# EasyEDA schematic 1-Schematic_EMWAVER_UNO_V4.json
TITLE: Sheet_1; REV: 1.0; Date: 2022-12-25; Sheet: 1/1; Drawn By: maarnotto; Company: Your Company
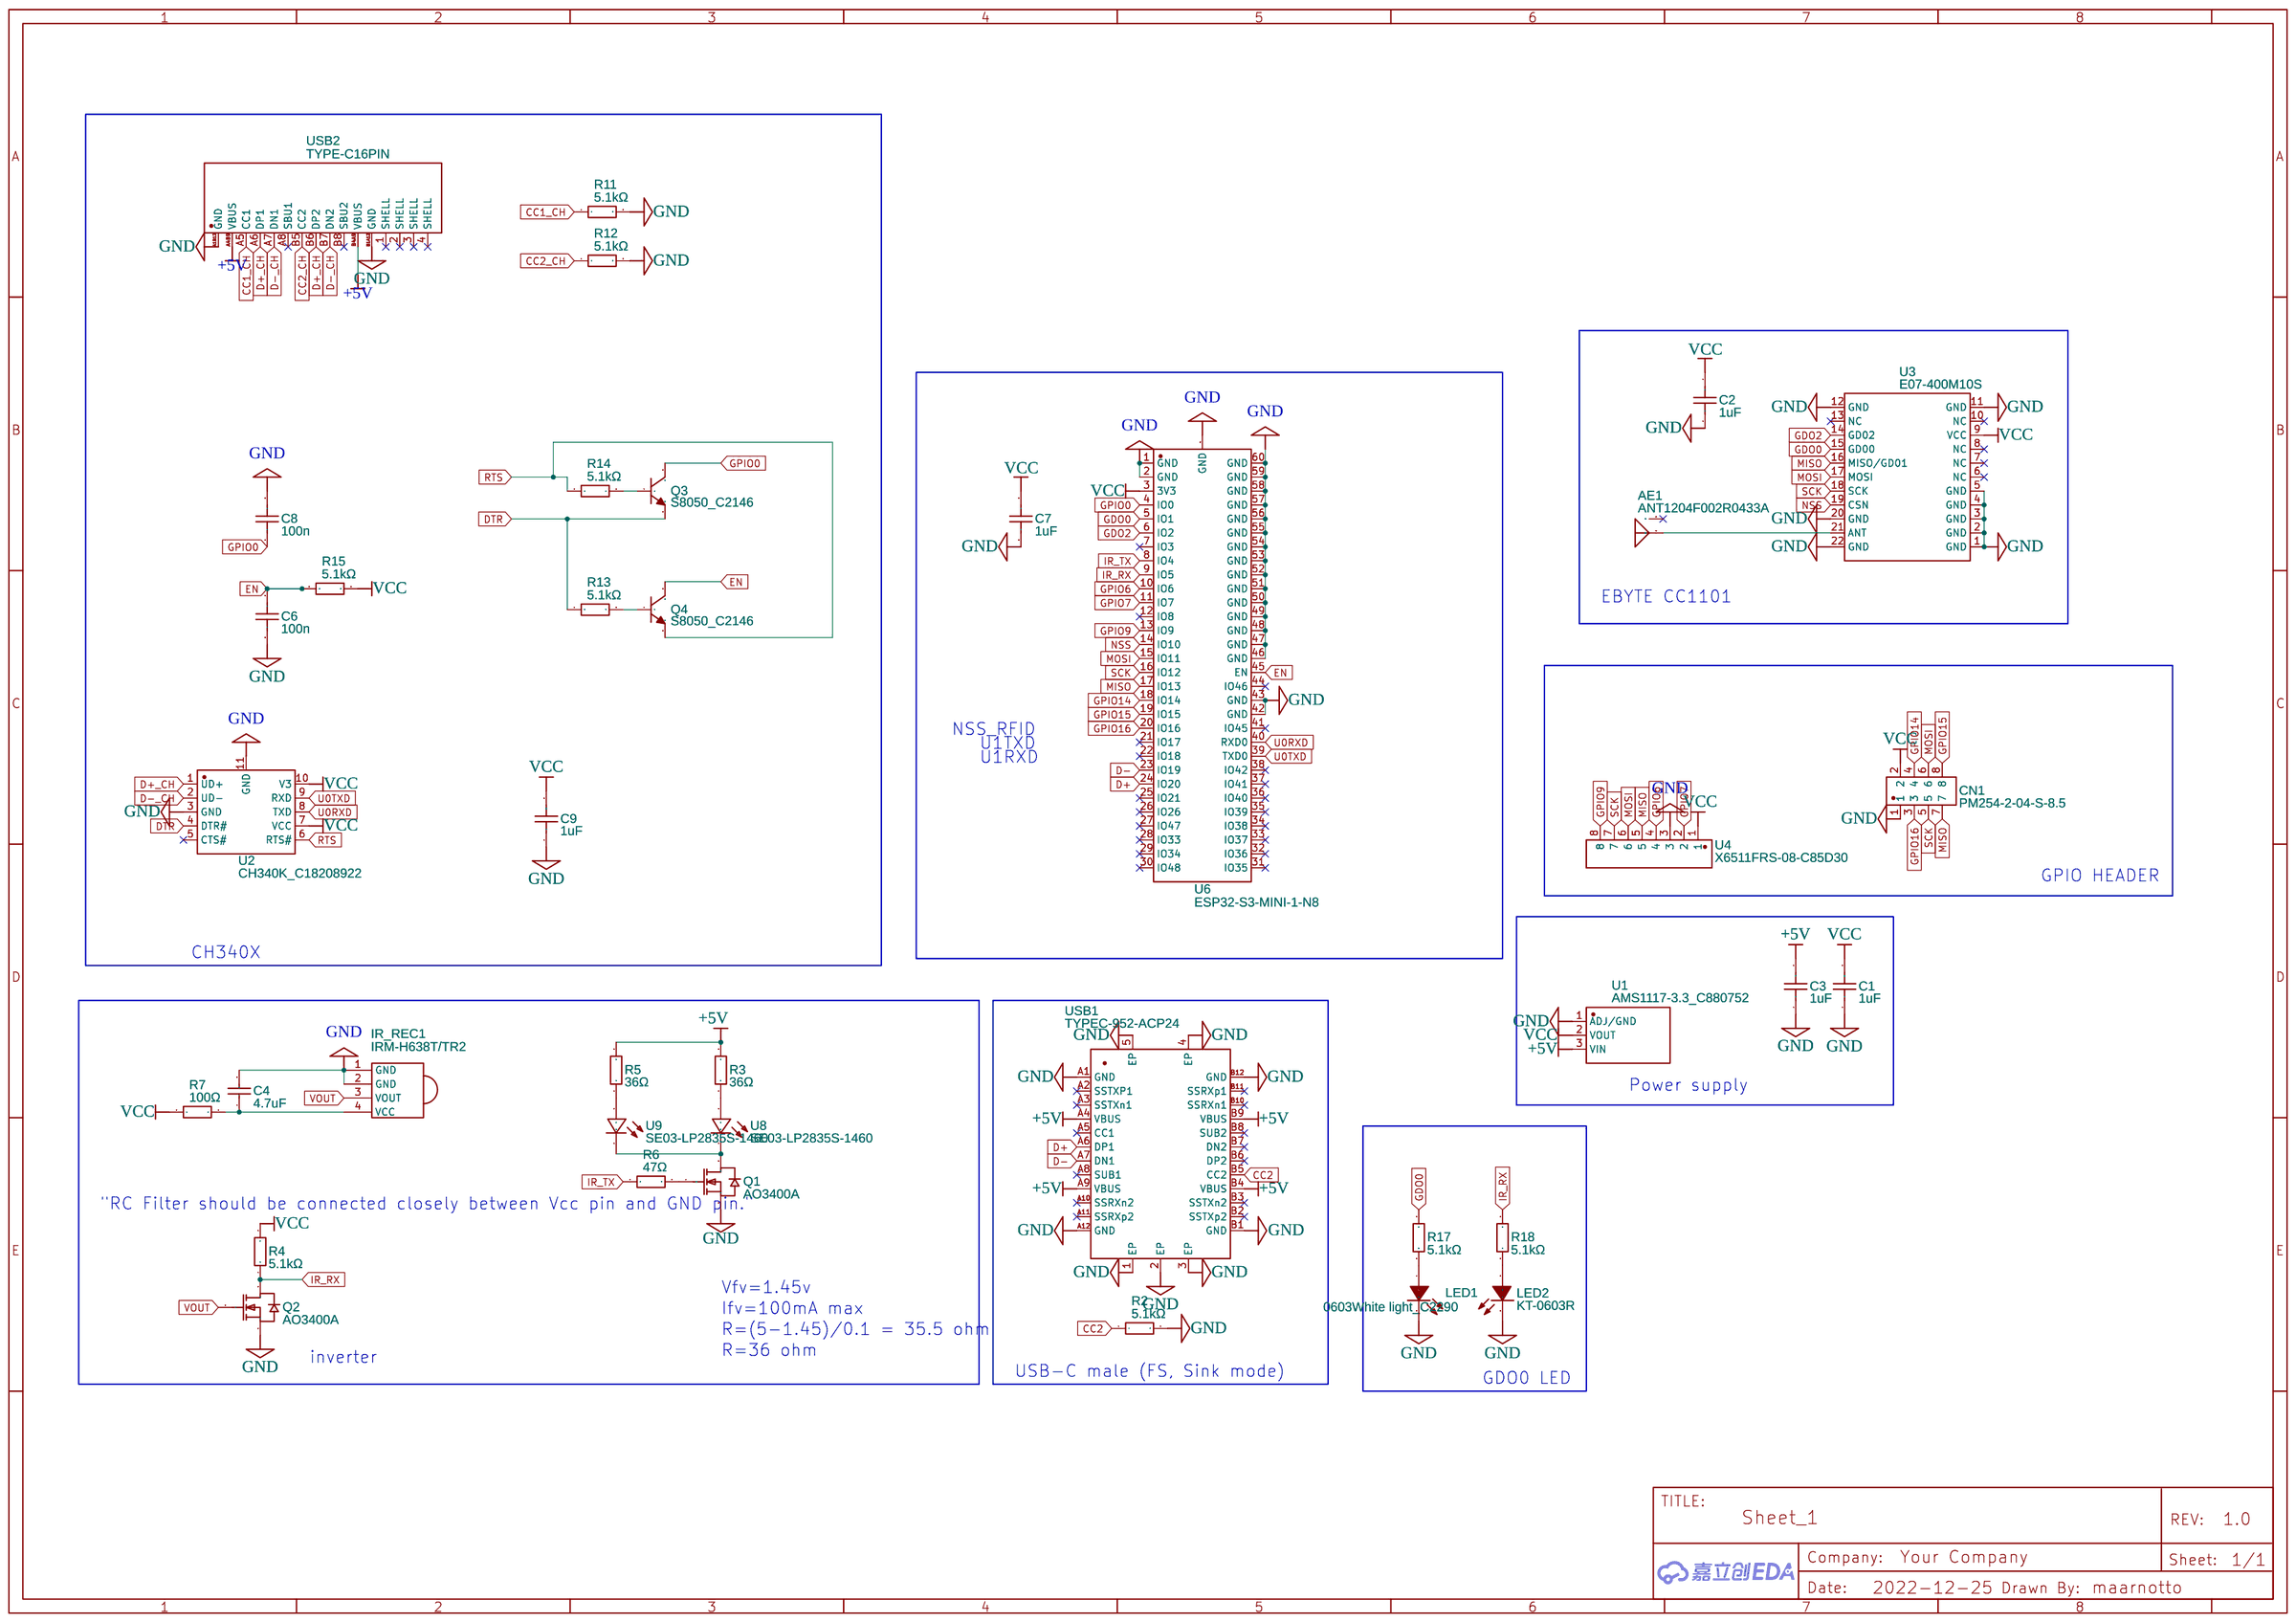
[diagram p0: schematic sheet]

## Parts
AE1  ANT1204F002R0433A  [ANT-SMD_L12.3-W4.0_ANT1204F002R0433A]
C1  1uF  [C0603]
C2  1uF  [C0603]
C3  1uF  [C0603]
C4  4.7uF  [C0603]
C6  100n  [C0402]
C7  1uF  [C0603]
C8  100n  [C0402]
C9  1uF  [C0603]
CN1  PM254-2-04-S-8.5  [HDR-SMD_8P-P2.54-V-F-R2-C4-S7.1]
IR_REC1  IRM-H638T/TR2  [SENSOR-SMD_IRM-H638T-TR2-TL]
LED1  0603White light_C2290  [LED0603-R-RD_WHITE]
LED2  KT-0603R  [LED0603-RD]
Q1  AO3400A  [SOT-23-3_L2.9-W1.6-P1.90-LS2.8-BR]
Q2  AO3400A  [SOT-23-3_L2.9-W1.6-P1.90-LS2.8-BR]
Q3  S8050_C2146  [SOT-23-3_L3.0-W1.7-P0.95-LS2.9-BR]
Q4  S8050_C2146  [SOT-23-3_L3.0-W1.7-P0.95-LS2.9-BR]
R2  5.1kΩ  [R0603]
R3  36Ω  [R1206]
R4  5.1kΩ  [R0603]
R5  36Ω  [R1206]
R6  47Ω  [R0805]
R7  100Ω  [R0805]
R11  5.1kΩ  [R0603]
R12  5.1kΩ  [R0603]
R13  5.1kΩ  [R0603]
R14  5.1kΩ  [R0603]
R15  5.1kΩ  [R0603]
R17  5.1kΩ  [R0603]
R18  5.1kΩ  [R0603]
U1  AMS1117-3.3_C880752  [SOT-89-3_L4.5-W2.5-P1.50-LS4.2-BR]
U2  CH340K_C18208922  [ESOP-10_L4.9-W3.9-P1.00-LS6.0-BL-EP]
U3  E07-400M10S  [COMM-SMD_E07-400M10S]
U4  X6511FRS-08-C85D30  [HDR-SMD_8P-P2.54-H-F-L11.5]
U6  ESP32-S3-MINI-1-N8  [BULETM-SMD_ESP32-S3-MINI-1-N8]
U8  SE03-LP2835S-1460  [SENSOR-SMD_L3.5-W2.8-FD]
U9  SE03-LP2835S-1460  [SENSOR-SMD_L3.5-W2.8-FD]
USB1  TYPEC-952-ACP24  [USB-C-SMD_TYPEC-952-ACP24]
USB2  TYPE-C16PIN  [USB-C-SMD_TYPE-C16PIN]

## Library data of the parts
AE1 = ANT1204F002R0433A: Contributor: LCSC; Supplier: LCSC; Supplier Part: C141525; Manufacturer: YAGEO(国巨); JLCPCB Part Class: Extended Part
C1-C3 C6-C9 = C_0603_US: Contributor: LCEDA_Lib
C4 = CL10A475KO8NNNC: Supplier: LCSC; Manufacturer: SAMSUNG(三星); Supplier Part: C19666; JLCPCB Part Class: Basic Part
CN1 = PM254-2-04-S-8.5: Contributor: lcsc; Supplier: LCSC; Supplier Part: C3975149; Manufacturer: HCTL(华灿天禄); JLCPCB Part Class: Extended Part
IR_REC1 = IRM-H638T/TR2: Supplier: LCSC; Manufacturer: EVERLIGHT(亿光); Supplier Part: C91447; JLCPCB Part Class: Extended Part
LED1 = 0603White light_C2290: Supplier: LCSC; Manufacturer: KENTO; Manufacturer Part: KT-0603W; Supplier Part: C2290; JLCPCB Part Class: Basic Part
LED2 = KT-0603R: Supplier: LCSC; Manufacturer: KENTO; Supplier Part: C2286; JLCPCB Part Class: Basic Part
Q1 Q2 = AO3400A: Supplier: LCSC; Manufacturer: AOS; Supplier Part: C20917; JLCPCB Part Class: Basic Part
Q3 Q4 = S8050_C2146: Supplier: LCSC; Manufacturer: CJ(江苏长电/长晶); Manufacturer Part: S8050 J3Y; Supplier Part: C2146; JLCPCB Part Class: Basic Part
R2 R4 R11-R15 R17 R18 = 0603WAF5101T5E: Supplier: LCSC; Manufacturer: UNI-ROYAL(厚声); Supplier Part: C23186; JLCPCB Part Class: Basic Part
R3 R5 = 1206W4J0360T5E: Supplier: LCSC; Manufacturer: UNI-ROYAL(厚声); Supplier Part: C25377; JLCPCB Part Class: Extended Part
R6 = 0805W8F470JT5E: Supplier: LCSC; Manufacturer: UNI-ROYAL(厚声); Supplier Part: C17714; JLCPCB Part Class: Basic Part
R7 = 0805W8F1000T5E: Supplier: LCSC; Manufacturer: UNI-ROYAL(厚声); Supplier Part: C17408; JLCPCB Part Class: Basic Part
U1 = AMS1117-3.3_C880752: Contributor: LCSC; Supplier: LCSC; Supplier Part: C880752; Manufacturer: Slkor(萨科微); Manufacturer Part: AMS1117-3.3; JLCPCB Part Class: Extended Part
U2 = CH340K_C18208922: Supplier: LCSC; Supplier Part: C18208922; Manufacturer: WCH(南京沁恒); Manufacturer Part: CH340K; Contributor: lcsc; JLCPCB Part Class: Extended Part
U3 = E07-400M10S: Supplier: LCSC; Supplier Part: C2965513; Manufacturer: EBYTE(亿佰特); JLCPCB Part Class: Extended Part; Contributor: lcsc
U4 = X6511FRS-08-C85D30: Contributor: lcsc; Supplier: LCSC; Supplier Part: C5142241; Manufacturer: XKB Connectivity(中国星坤); JLCPCB Part Class: Extended Part
U6 = ESP32-S3-MINI-1-N8: Contributor: lcsc; Supplier: LCSC; Supplier Part: C2913206; Manufacturer: ESPRESSIF(乐鑫); JLCPCB Part Class: Extended Part
U8 U9 = SE03-LP2835S-1460: Contributor: lcsc; Supplier: LCSC; Supplier Part: C5205253; Manufacturer: XSSY(旭晟); JLCPCB Part Class: Extended Part
USB1 = TYPEC-952-ACP24: Contributor: LCSC; Supplier: LCSC; Supplier Part: C2840398; Manufacturer: XUNPU(讯普); JLCPCB Part Class: Extended Part
USB2 = TYPE-C16PIN: Contributor: LCSC; Supplier: LCSC; Supplier Part: C393939; Manufacturer: SHOU HAN(首韩); JLCPCB Part Class: Extended Part

## Nets
+5V: C3.2 R3.2 R5.2 U1.3(VIN) USB1.A4(VBUS) USB1.A9(VBUS) USB1.B4(VBUS) USB1.B9(VBUS) USB2.A4B9(VBUS) USB2.B4A9(VBUS)
GND: C1.1 C2.2 C3.1 C4.2 C6.2 C7.2 C8.2 C9.1 CN1.1 IR_REC1.1(GND) IR_REC1.2(GND) LED1.2(K) LED2.1(K) Q1.2(S) Q2.2(S) R2.2 R11.2 R12.2 U1.1(ADJ/GND) U2.3(GND) U2.11(GND) U3.1(GND) U3.2(GND) U3.3(GND) U3.4(GND) U3.5(GND) U3.11(GND) U3.12(GND) U3.20(GND) U3.22(GND) U4.3 U6.1(GND) U6.2(GND) U6.42(GND) U6.43(GND) U6.46(GND) U6.47(GND) U6.48(GND) U6.49(GND) U6.50(GND) U6.51(GND) U6.52(GND) U6.53(GND) U6.54(GND) U6.55(GND) U6.56(GND) U6.57(GND) U6.58(GND) U6.59(GND) U6.60(GND) U6.GND USB1.1(EP) USB1.2(EP) USB1.3(EP) USB1.4(EP) USB1.5(EP) USB1.A1(GND) USB1.A12(GND) USB1.B1(GND) USB1.B12(GND) USB2.A1B12(GND) USB2.B1A12(GND)
VCC: C1.2 C2.1 C7.1 C9.2 CN1.2 R4.2 R7.1 R15.2 U1.2(VOUT) U2.7(VCC) U2.10(V3) U3.9(VCC) U4.1 U6.3(3V3)
CC1_CH: R11.1 USB2.A5(CC1)
CC2: R2.1 USB1.B5(CC2)
CC2_CH: R12.1 USB2.B5(CC2)
D+: U6.24(IO20) USB1.A6(DP1)
D+_CH: U2.1(UD+) USB2.A6(DP1) USB2.B6(DP2)
D-: U6.23(IO19) USB1.A7(DN1)
D-_CH: U2.2(UD-) USB2.A7(DN1) USB2.B7(DN2)
DTR: Q3.2(E) R13.1 U2.4(DTR#)
EN: C6.1 Q4.3(C) R15.1 U6.45(EN)
GDO0: R17.2 U3.15(GD00) U6.5(IO1)
GDO2: U3.14(GD02) U6.6(IO2)
GPIO0: C8.1 Q3.3(C) U6.4(IO0)
GPIO6: U4.4 U6.10(IO6)
GPIO7: U4.2 U6.11(IO7)
GPIO9: U4.8 U6.13(IO9)
GPIO14: CN1.4 U6.18(IO14)
GPIO15: CN1.8 U6.19(IO15)
GPIO16: CN1.3 U6.20(IO16)
IR_RX: Q2.3(D) R4.1 R18.2 U6.9(IO5)
IR_TX: R6.1 U6.8(IO4)
MISO: CN1.7 U3.16(MISO/GD01) U4.5 U6.17(IO13)
MOSI: CN1.6 U3.17(MOSI) U4.6 U6.15(IO11)
NSS: U3.19(CSN) U6.14(IO10)
RTS: Q4.2(E) R14.1 U2.6(RTS#)
SCK: CN1.5 U3.18(SCK) U4.7 U6.16(IO12)
U0RXD: U2.8(TXD) U6.40(RXD0)
U0TXD: U2.9(RXD) U6.39(TXD0)
VOUT: IR_REC1.3(VOUT) Q2.1(G)
Net-(AE1-S1): AE1.S1 U3.21(ANT)
Net-(C4-1): C4.1 IR_REC1.4(VCC) R7.2
Net-(LED1-1): LED1.1(A) R17.1
Net-(LED2-2): LED2.2(A) R18.1
Net-(Q1-1): Q1.1(G) R6.2
Net-(Q1-3): Q1.3(D) U8.2(C) U9.2(C)
Net-(Q3-1): Q3.1(B) R14.2
Net-(Q4-1): Q4.1(B) R13.2
Net-(R3-1): R3.1 U8.1(A)
Net-(R5-1): R5.1 U9.1(A)

Not connected (* = marked no-connect by the designer): AE1 S2*; U2 5(CTS#)*; U3 6(NC)* 7(NC)* 8(NC)* 10(NC)* 13(NC)*; U6 7(IO3)* 12(IO8)* 21(IO17)* 22(IO18)* 25(IO21)* 26(IO26)* 27(IO47)* 28(IO33)* 29(IO34)* 30(IO48)* 31(IO35)* 32(IO36)* 33(IO37)* 34(IO38)* 35(IO39)* 36(IO40)* 37(IO41)* 38(IO42)* 41(IO45)* 44(IO46)*; USB1 A2(SSTXP1)* A3(SSTXn1)* A5(CC1)* A8(SUB1)* A10(SSRXn2)* A11(SSRXp2)* B2(SSTXp2)* B3(SSTXn2)* B6(DP2)* B7(DN2)* B8(SUB2)* B10(SSRXn1)* B11(SSRXp1)*; USB2 1(SHELL)* 2(SHELL)* 3(SHELL)* 4(SHELL)* A8(SBU1)* B8(SBU2)*

## Notes on the sheet
- EBYTE CC1101
- NSS_RFID
- U1TXD
- U1RXD
- GPIO HEADER
- CH340X
- Power supply
- "RC Filter should be connected closely between Vcc pin and GND pin."
- Vfv=1.45v
- Ifv=100mA max
- R=(5-1.45)/0.1 = 35.5 ohm
- inverter
- R=36 ohm
- USB-C male (FS, Sink mode)
- GDO0 LED
